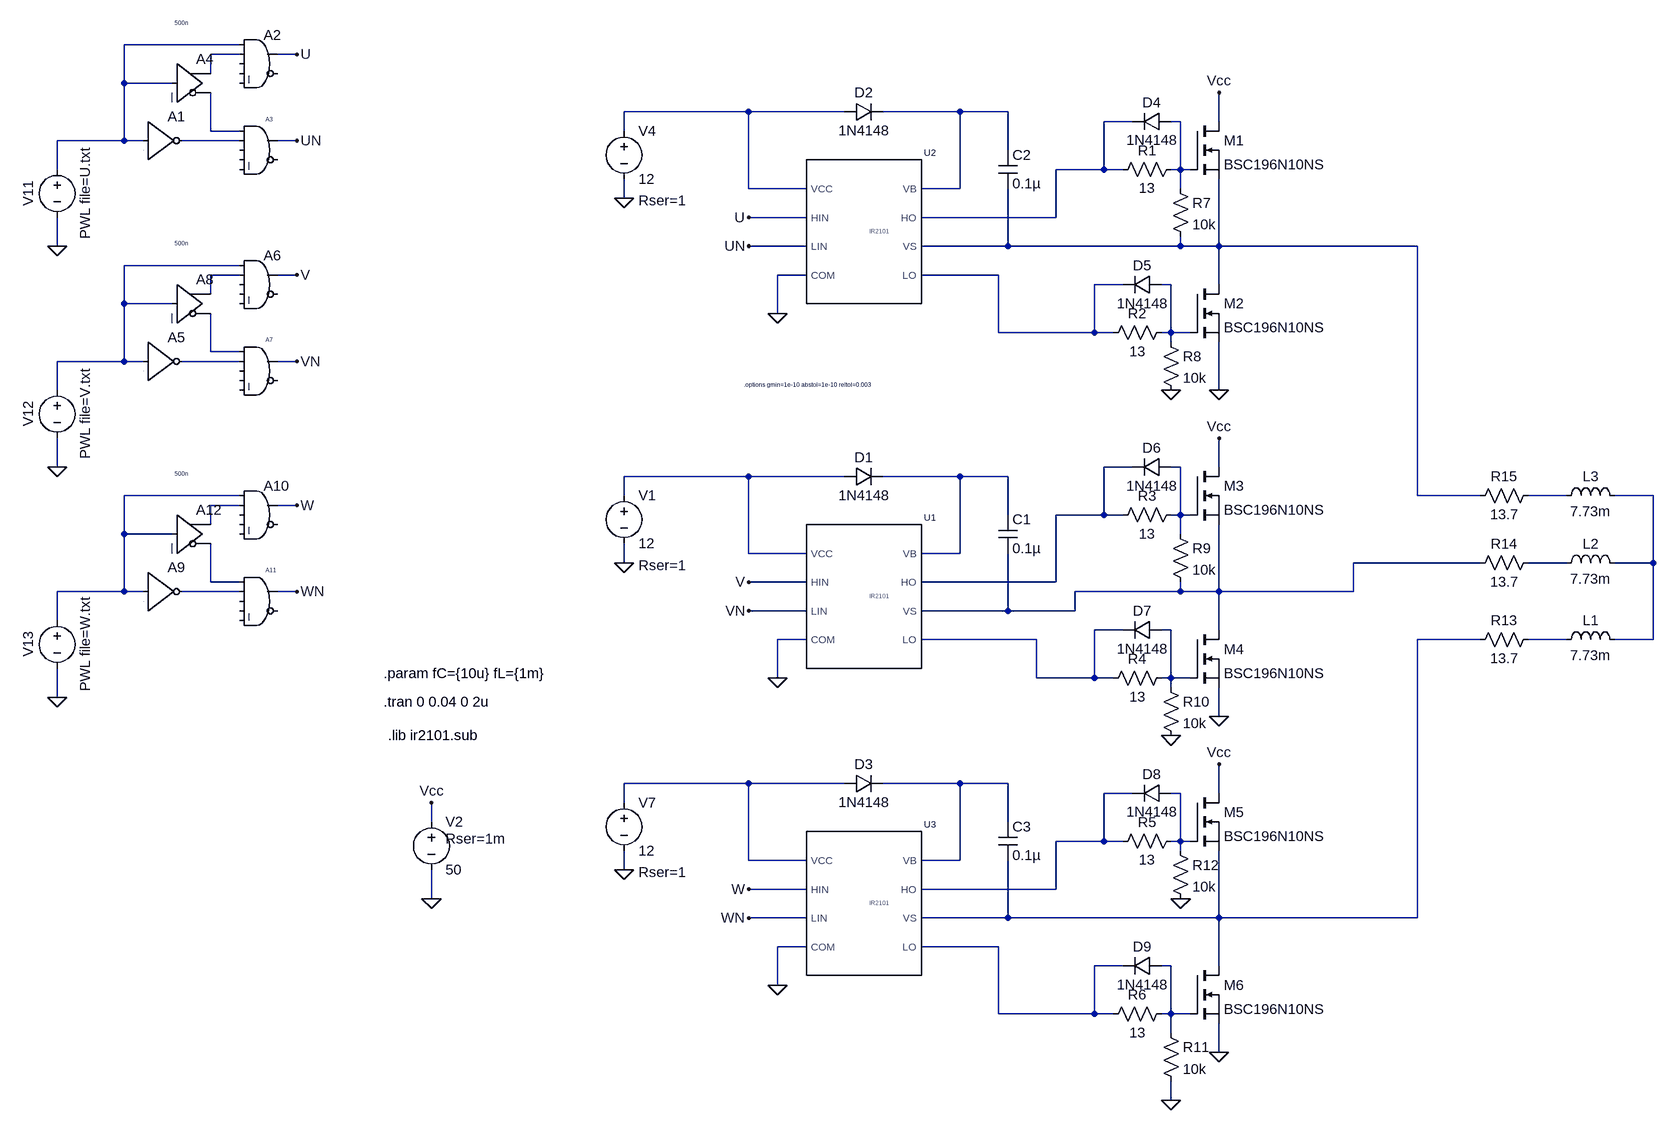
[diagram p0: schematic Inverter_v5.asc]
Inverter_v5.asc, the LTspice schematic file:
Version 4
SHEET 1 2136 1396
WIRE -1728 -384 -1920 -384
WIRE -1728 -368 -1776 -368
WIRE -1632 -368 -1664 -368
WIRE -1776 -336 -1776 -368
WIRE -1920 -320 -1920 -384
WIRE -1840 -320 -1920 -320
WIRE -704 -272 -912 -272
WIRE -544 -272 -704 -272
WIRE -352 -272 -480 -272
WIRE -272 -272 -352 -272
WIRE -64 -256 -112 -256
WIRE 16 -256 0 -256
WIRE 80 -256 80 -304
WIRE -1776 -240 -1776 -304
WIRE -1728 -240 -1776 -240
WIRE -912 -240 -912 -272
WIRE -1920 -224 -1920 -320
WIRE -1920 -224 -2032 -224
WIRE -1888 -224 -1920 -224
WIRE -1728 -224 -1824 -224
WIRE -1632 -224 -1664 -224
WIRE -272 -208 -272 -272
WIRE -2032 -176 -2032 -224
WIRE -112 -176 -112 -256
WIRE -112 -176 -192 -176
WIRE -80 -176 -112 -176
WIRE 16 -176 16 -256
WIRE 16 -176 0 -176
WIRE 32 -176 16 -176
WIRE -704 -144 -704 -272
WIRE -608 -144 -704 -144
WIRE -352 -144 -352 -272
WIRE -352 -144 -416 -144
WIRE 16 -144 16 -176
WIRE -912 -128 -912 -160
WIRE -608 -96 -704 -96
WIRE -192 -96 -192 -176
WIRE -192 -96 -416 -96
WIRE -2032 -48 -2032 -96
WIRE -608 -48 -704 -48
WIRE -272 -48 -272 -144
WIRE -272 -48 -416 -48
WIRE 16 -48 16 -64
WIRE 16 -48 -272 -48
WIRE 80 -48 80 -160
WIRE 80 -48 16 -48
WIRE 416 -48 80 -48
WIRE -1728 -16 -1920 -16
WIRE -1728 0 -1776 0
WIRE -1632 0 -1664 0
WIRE -608 0 -656 0
WIRE -288 0 -416 0
WIRE -80 16 -128 16
WIRE 0 16 -16 16
WIRE 80 16 80 -48
WIRE -1776 32 -1776 0
WIRE -1920 48 -1920 -16
WIRE -1840 48 -1920 48
WIRE -656 64 -656 0
WIRE -288 96 -288 0
WIRE -128 96 -128 16
WIRE -128 96 -288 96
WIRE -96 96 -128 96
WIRE 0 96 0 16
WIRE 0 96 -16 96
WIRE 32 96 0 96
WIRE 0 112 0 96
WIRE -1776 128 -1776 64
WIRE -1728 128 -1776 128
WIRE -1920 144 -1920 48
WIRE -1920 144 -2032 144
WIRE -1888 144 -1920 144
WIRE -1728 144 -1824 144
WIRE -1632 144 -1664 144
WIRE -2032 192 -2032 144
WIRE 80 192 80 112
WIRE -2032 320 -2032 272
WIRE -64 320 -112 320
WIRE 16 320 0 320
WIRE 80 320 80 272
WIRE -704 336 -912 336
WIRE -544 336 -704 336
WIRE -352 336 -480 336
WIRE -272 336 -352 336
WIRE -1728 368 -1920 368
WIRE -912 368 -912 336
WIRE 416 368 416 -48
WIRE 1504 368 416 368
WIRE 1648 368 1584 368
WIRE 1792 368 1728 368
WIRE -1728 384 -1776 384
WIRE -1632 384 -1664 384
WIRE -272 400 -272 336
WIRE -112 400 -112 320
WIRE -112 400 -192 400
WIRE -80 400 -112 400
WIRE 16 400 16 320
WIRE 16 400 0 400
WIRE 32 400 16 400
WIRE -1776 416 -1776 384
WIRE -1920 432 -1920 368
WIRE -1840 432 -1920 432
WIRE 16 432 16 400
WIRE -704 464 -704 336
WIRE -608 464 -704 464
WIRE -352 464 -352 336
WIRE -352 464 -416 464
WIRE -912 480 -912 448
WIRE 1504 480 304 480
WIRE 1648 480 1584 480
WIRE 1792 480 1792 368
WIRE 1792 480 1728 480
WIRE -1776 512 -1776 448
WIRE -1728 512 -1776 512
WIRE -608 512 -704 512
WIRE -192 512 -192 400
WIRE -192 512 -416 512
WIRE -1920 528 -1920 432
WIRE -1920 528 -2032 528
WIRE -1888 528 -1920 528
WIRE -1728 528 -1824 528
WIRE -1632 528 -1664 528
WIRE 16 528 16 512
WIRE 16 528 -160 528
WIRE 80 528 80 416
WIRE 80 528 16 528
WIRE 304 528 304 480
WIRE 304 528 80 528
WIRE -608 560 -704 560
WIRE -272 560 -272 464
WIRE -272 560 -416 560
WIRE -160 560 -160 528
WIRE -160 560 -272 560
WIRE -2032 576 -2032 528
WIRE -80 592 -128 592
WIRE 0 592 -16 592
WIRE 80 592 80 528
WIRE -608 608 -656 608
WIRE -224 608 -416 608
WIRE 1504 608 416 608
WIRE 1648 608 1584 608
WIRE 1792 608 1792 480
WIRE 1792 608 1728 608
WIRE -656 672 -656 608
WIRE -224 672 -224 608
WIRE -128 672 -128 592
WIRE -128 672 -224 672
WIRE -96 672 -128 672
WIRE 0 672 0 592
WIRE 0 672 -16 672
WIRE 32 672 0 672
WIRE 0 688 0 672
WIRE -2032 704 -2032 656
WIRE 80 736 80 688
WIRE -704 848 -912 848
WIRE -544 848 -704 848
WIRE -352 848 -480 848
WIRE -272 848 -352 848
WIRE -64 864 -112 864
WIRE 16 864 0 864
WIRE 80 864 80 816
WIRE -912 880 -912 848
WIRE -1408 912 -1408 880
WIRE -272 912 -272 848
WIRE -112 944 -112 864
WIRE -112 944 -192 944
WIRE -80 944 -112 944
WIRE 16 944 16 864
WIRE 16 944 0 944
WIRE 32 944 16 944
WIRE 16 960 16 944
WIRE -704 976 -704 848
WIRE -608 976 -704 976
WIRE -352 976 -352 848
WIRE -352 976 -416 976
WIRE -912 992 -912 960
WIRE -608 1024 -704 1024
WIRE -192 1024 -192 944
WIRE -192 1024 -416 1024
WIRE -1408 1040 -1408 992
WIRE -608 1072 -704 1072
WIRE -272 1072 -272 976
WIRE -272 1072 -416 1072
WIRE 80 1072 80 960
WIRE 80 1072 -272 1072
WIRE 416 1072 416 608
WIRE 416 1072 80 1072
WIRE -608 1120 -656 1120
WIRE -288 1120 -416 1120
WIRE -80 1152 -128 1152
WIRE 0 1152 -16 1152
WIRE 80 1152 80 1072
WIRE -656 1184 -656 1120
WIRE -288 1232 -288 1120
WIRE -128 1232 -128 1152
WIRE -128 1232 -288 1232
WIRE -96 1232 -128 1232
WIRE 0 1232 0 1152
WIRE 0 1232 -16 1232
WIRE 32 1232 0 1232
WIRE 0 1264 0 1232
WIRE 80 1296 80 1248
WIRE 0 1376 0 1344
FLAG 80 192 0
FLAG 80 736 0
FLAG -912 992 0
FLAG 80 1296 0
FLAG -1408 880 Vcc
FLAG -1408 1040 0
FLAG 80 -304 Vcc
FLAG 80 272 Vcc
FLAG 80 816 Vcc
FLAG 0 192 0
FLAG 0 768 0
FLAG 0 1376 0
FLAG 16 1040 0
FLAG -656 1184 0
FLAG -912 480 0
FLAG -656 672 0
FLAG -912 -128 0
FLAG -656 64 0
FLAG -704 -96 U
FLAG -704 -48 UN
FLAG -704 560 VN
FLAG -704 1072 WN
FLAG -704 1024 W
FLAG -704 512 V
FLAG -1632 -368 U
FLAG -1632 0 V
FLAG -1632 384 W
FLAG -2032 -48 0
FLAG -2032 320 0
FLAG -2032 704 0
FLAG -1632 144 VN
FLAG -1632 -224 UN
FLAG -1632 528 WN
SYMBOL res -112 112 R270
WINDOW 0 32 56 VTop 2
WINDOW 3 0 56 VBottom 2
SYMATTR InstName R2
SYMATTR Value 13
SYMBOL nmos 32 -256 R0
SYMATTR InstName M1
SYMATTR Value BSC196N10NS
SYMBOL nmos 32 16 R0
SYMATTR InstName M2
SYMATTR Value BSC196N10NS
SYMBOL res -96 416 R270
WINDOW 0 32 56 VTop 2
WINDOW 3 0 56 VBottom 2
SYMATTR InstName R3
SYMATTR Value 13
SYMBOL res -112 688 R270
WINDOW 0 32 56 VTop 2
WINDOW 3 0 56 VBottom 2
SYMATTR InstName R4
SYMATTR Value 13
SYMBOL nmos 32 320 R0
SYMATTR InstName M3
SYMATTR Value BSC196N10NS
SYMBOL nmos 32 592 R0
SYMATTR InstName M4
SYMATTR Value BSC196N10NS
SYMBOL voltage -912 864 R0
WINDOW 123 0 0 Left 2
WINDOW 39 24 132 Left 2
SYMATTR SpiceLine Rser=1
SYMATTR InstName V7
SYMATTR Value 12
SYMBOL diode -544 864 R270
WINDOW 0 32 32 VTop 2
WINDOW 3 0 32 VBottom 2
SYMATTR InstName D3
SYMATTR Value 1N4148
SYMBOL cap -288 912 R0
SYMATTR InstName C3
SYMATTR Value 0.1µ
SYMBOL res -96 960 R270
WINDOW 0 32 56 VTop 2
WINDOW 3 0 56 VBottom 2
SYMATTR InstName R5
SYMATTR Value 13
SYMBOL res -112 1248 R270
WINDOW 0 32 56 VTop 2
WINDOW 3 0 56 VBottom 2
SYMATTR InstName R6
SYMATTR Value 13
SYMBOL nmos 32 864 R0
SYMATTR InstName M5
SYMATTR Value BSC196N10NS
SYMBOL nmos 32 1152 R0
SYMATTR InstName M6
SYMATTR Value BSC196N10NS
SYMBOL voltage -1408 896 R0
WINDOW 123 0 0 Left 0
WINDOW 39 24 44 Left 2
SYMATTR SpiceLine Rser=1m
SYMATTR InstName V2
SYMATTR Value 50
SYMBOL res 1488 624 R270
WINDOW 0 32 56 VTop 2
WINDOW 3 0 56 VBottom 2
SYMATTR InstName R13
SYMATTR Value 13.7
SYMBOL res 1488 496 R270
WINDOW 0 32 56 VTop 2
WINDOW 3 0 56 VBottom 2
SYMATTR InstName R14
SYMATTR Value 13.7
SYMBOL res 1488 384 R270
WINDOW 0 32 56 VTop 2
WINDOW 3 0 56 VBottom 2
SYMATTR InstName R15
SYMATTR Value 13.7
SYMBOL ind 1632 624 R270
WINDOW 0 32 56 VTop 2
WINDOW 3 5 56 VBottom 2
SYMATTR InstName L1
SYMATTR Value 7.73m
SYMBOL ind 1632 496 R270
WINDOW 0 32 56 VTop 2
WINDOW 3 5 56 VBottom 2
SYMATTR InstName L2
SYMATTR Value 7.73m
SYMBOL ind 1632 384 R270
WINDOW 0 32 56 VTop 2
WINDOW 3 5 56 VBottom 2
SYMATTR InstName L3
SYMATTR Value 7.73m
SYMBOL diode 0 -272 R90
WINDOW 0 0 32 VBottom 2
WINDOW 3 32 32 VTop 2
SYMATTR InstName D4
SYMATTR Value 1N4148
SYMBOL diode -16 0 R90
WINDOW 0 0 32 VBottom 2
WINDOW 3 32 32 VTop 2
SYMATTR InstName D5
SYMATTR Value 1N4148
SYMBOL diode 0 304 R90
WINDOW 0 0 32 VBottom 2
WINDOW 3 32 32 VTop 2
SYMATTR InstName D6
SYMATTR Value 1N4148
SYMBOL diode -16 576 R90
WINDOW 0 0 32 VBottom 2
WINDOW 3 32 32 VTop 2
SYMATTR InstName D7
SYMATTR Value 1N4148
SYMBOL diode 0 848 R90
WINDOW 0 0 32 VBottom 2
WINDOW 3 32 32 VTop 2
SYMATTR InstName D8
SYMATTR Value 1N4148
SYMBOL diode -16 1136 R90
WINDOW 0 0 32 VBottom 2
WINDOW 3 32 32 VTop 2
SYMATTR InstName D9
SYMATTR Value 1N4148
SYMBOL res -96 -160 R270
WINDOW 0 32 56 VTop 2
WINDOW 3 0 56 VBottom 2
SYMATTR InstName R1
SYMATTR Value 13
SYMBOL res 0 -160 R0
SYMATTR InstName R7
SYMATTR Value 10k
SYMBOL res -16 96 R0
SYMATTR InstName R8
SYMATTR Value 10k
SYMBOL res 0 416 R0
SYMATTR InstName R9
SYMATTR Value 10k
SYMBOL res -16 672 R0
SYMATTR InstName R10
SYMATTR Value 10k
SYMBOL res -16 1248 R0
SYMATTR InstName R11
SYMATTR Value 10k
SYMBOL res 0 944 R0
SYMATTR InstName R12
SYMATTR Value 10k
SYMBOL ir2101 -512 1056 R0
SYMATTR InstName U3
SYMBOL voltage -912 352 R0
WINDOW 123 0 0 Left 2
WINDOW 39 24 132 Left 2
SYMATTR SpiceLine Rser=1
SYMATTR InstName V1
SYMATTR Value 12
SYMBOL diode -544 352 R270
WINDOW 0 32 32 VTop 2
WINDOW 3 0 32 VBottom 2
SYMATTR InstName D1
SYMATTR Value 1N4148
SYMBOL cap -288 400 R0
SYMATTR InstName C1
SYMATTR Value 0.1µ
SYMBOL ir2101 -512 544 R0
SYMATTR InstName U1
SYMBOL voltage -912 -256 R0
WINDOW 123 0 0 Left 2
WINDOW 39 24 132 Left 2
SYMATTR SpiceLine Rser=1
SYMATTR InstName V4
SYMATTR Value 12
SYMBOL diode -544 -256 R270
WINDOW 0 32 32 VTop 2
WINDOW 3 0 32 VBottom 2
SYMATTR InstName D2
SYMATTR Value 1N4148
SYMBOL cap -288 -208 R0
SYMATTR InstName C2
SYMATTR Value 0.1µ
SYMBOL ir2101 -512 -64 R0
SYMATTR InstName U2
SYMBOL voltage -2032 -192 R0
WINDOW 0 -32 56 VBottom 2
WINDOW 3 32 56 VTop 2
WINDOW 123 0 0 Left 0
WINDOW 39 0 0 Left 0
SYMATTR InstName V11
SYMATTR Value PWL file=U.txt
SYMBOL voltage -2032 176 R0
WINDOW 0 -32 56 VBottom 2
WINDOW 3 32 56 VTop 2
WINDOW 123 0 0 Left 0
WINDOW 39 0 0 Left 0
SYMATTR InstName V12
SYMATTR Value PWL file=V.txt
SYMBOL voltage -2032 560 R0
WINDOW 0 -32 56 VBottom 2
WINDOW 3 32 56 VTop 2
WINDOW 123 0 0 Left 0
WINDOW 39 0 0 Left 0
SYMATTR InstName V13
SYMATTR Value PWL file=W.txt
SYMBOL Digital\\inv -1888 -288 R0
WINDOW 3 0 0 Invisible 0
SYMATTR Value Vhigh=10 Td=0.01u
SYMATTR InstName A1
SYMBOL Digital\\and -1696 -416 R0
WINDOW 3 -70 -9 Invisible 0
SYMATTR Value Vhigh=10
SYMATTR InstName A2
SYMATTR Value2 tripdt=20n
SYMBOL Digital\\and -1696 -272 R0
WINDOW 0 12 13 Left 0
WINDOW 3 -54 132 Invisible 0
SYMATTR InstName A3
SYMATTR Value Vhigh=10
SYMATTR Value2 tripdt=20n
SYMBOL Digital\\buf -1840 -384 R0
WINDOW 3 4 -36 Left 0
SYMATTR Value 500n
SYMATTR InstName A4
SYMATTR Value2 Vhigh=10
SYMBOL Digital\\inv -1888 80 R0
WINDOW 3 0 0 Invisible 0
SYMATTR Value Vhigh=10 Td=0.01u
SYMATTR InstName A5
SYMBOL Digital\\and -1696 -48 R0
WINDOW 3 -70 -9 Invisible 0
SYMATTR Value Vhigh=10
SYMATTR InstName A6
SYMATTR Value2 tripdt=20n
SYMBOL Digital\\and -1696 96 R0
WINDOW 0 12 13 Left 0
WINDOW 3 -54 132 Invisible 0
SYMATTR InstName A7
SYMATTR Value Vhigh=10
SYMATTR Value2 tripdt=20n
SYMBOL Digital\\buf -1840 -16 R0
WINDOW 3 4 -36 Left 0
SYMATTR Value 500n
SYMATTR InstName A8
SYMATTR Value2 Vhigh=10
SYMBOL Digital\\inv -1888 464 R0
WINDOW 3 0 0 Invisible 0
SYMATTR Value Vhigh=10 Td=0.01u
SYMATTR InstName A9
SYMBOL Digital\\and -1696 336 R0
WINDOW 3 -70 -9 Invisible 0
SYMATTR Value Vhigh=10
SYMATTR InstName A10
SYMATTR Value2 tripdt=20n
SYMBOL Digital\\and -1696 480 R0
WINDOW 0 12 13 Left 0
WINDOW 3 -54 132 Invisible 0
SYMATTR InstName A11
SYMATTR Value Vhigh=10
SYMATTR Value2 tripdt=20n
SYMBOL Digital\\buf -1840 368 R0
WINDOW 3 4 -36 Left 0
SYMATTR Value 500n
SYMATTR InstName A12
SYMATTR Value2 Vhigh=10
TEXT -712 184 Left 0 !.options gmin=1e-10 abstol=1e-10 reltol=0.003
TEXT -1488 712 Left 2 !.tran 0 0.04 0 2u
TEXT -1488 664 Left 2 !.param fC={10u} fL={1m}
TEXT -1480 768 Left 2 !.lib ir2101.sub

The netlist it stands for:
* Inverter_v5.asc
R2 N012 N013 13
M1 Vcc N006 N009 N009 BSC196N10NS
M2 N009 N013 0 0 BSC196N10NS
R3 N016 N017 13
R4 N028 N029 13
M3 Vcc N017 N024 N024 BSC196N10NS
M4 N024 N029 0 0 BSC196N10NS
V7 N032 0 12 Rser=1
D3 N032 N033 1N4148
C3 N033 N030 0.1µ
R5 N034 N035 13
R6 N036 N037 13
M5 Vcc N035 N030 N030 BSC196N10NS
M6 N030 N037 0 0 BSC196N10NS
V2 Vcc 0 50 Rser=1m
R13 N030 N031 13.7
R14 N024 N025 13.7
R15 N009 N021 13.7
L1 N031 N022 7.73m
L2 N025 N022 7.73m
L3 N021 N022 7.73m
D4 N006 N005 1N4148
D5 N013 N012 1N4148
D6 N017 N016 1N4148
D7 N029 N028 1N4148
D8 N035 N034 1N4148
D9 N037 N036 1N4148
R1 N005 N006 13
R7 N006 N009 10k
R8 N013 0 10k
R9 N017 N024 10k
R10 N029 0 10k
R11 N037 0 10k
R12 N035 0 10k
XU3 N032 W WN 0 N033 N034 N030 N036 ir2101  ; pins VCC HIN LIN COM VB HO VS LO
V1 N018 0 12 Rser=1
D1 N018 N019 1N4148
C1 N019 N024 0.1µ
XU1 N018 V VN 0 N019 N016 N024 N028 ir2101  ; pins VCC HIN LIN COM VB HO VS LO
V4 N003 0 12 Rser=1
D2 N003 N004 1N4148
C2 N004 N009 0.1µ
XU2 N003 U UN 0 N004 N005 N009 N012 ir2101  ; pins VCC HIN LIN COM VB HO VS LO
V11 N001 0 PWL file=U.txt
V12 N010 0 PWL file=V.txt
V13 N020 0 PWL file=W.txt
A1 N001 0 0 0 0 N008 0 0 BUF Vhigh=10 Td=0.01u
A2 N001 N002 0 0 0 0 U 0 AND Vhigh=10 tripdt=20n
A3 N007 N008 0 0 0 0 UN 0 AND Vhigh=10 tripdt=20n
A4 N001 0 0 0 0 N007 N002 0 BUF 500n Vhigh=10
A5 N010 0 0 0 0 N015 0 0 BUF Vhigh=10 Td=0.01u
A6 N010 N011 0 0 0 0 V 0 AND Vhigh=10 tripdt=20n
A7 N014 N015 0 0 0 0 VN 0 AND Vhigh=10 tripdt=20n
A8 N010 0 0 0 0 N014 N011 0 BUF 500n Vhigh=10
A9 N020 0 0 0 0 N027 0 0 BUF Vhigh=10 Td=0.01u
A10 N020 N023 0 0 0 0 W 0 AND Vhigh=10 tripdt=20n
A11 N026 N027 0 0 0 0 WN 0 AND Vhigh=10 tripdt=20n
A12 N020 0 0 0 0 N026 N023 0 BUF 500n Vhigh=10
.model D D
.lib standard.dio
.model NMOS NMOS
.model PMOS PMOS
.lib standard.mos
.options gmin=1e-10 abstol=1e-10 reltol=0.003
.tran 0 0.04 0 2u
.param fC={10u} fL={1m}
.lib ir2101.sub
.backanno
.end